# EAGLE design schematic (EAGLE 9.6.1)
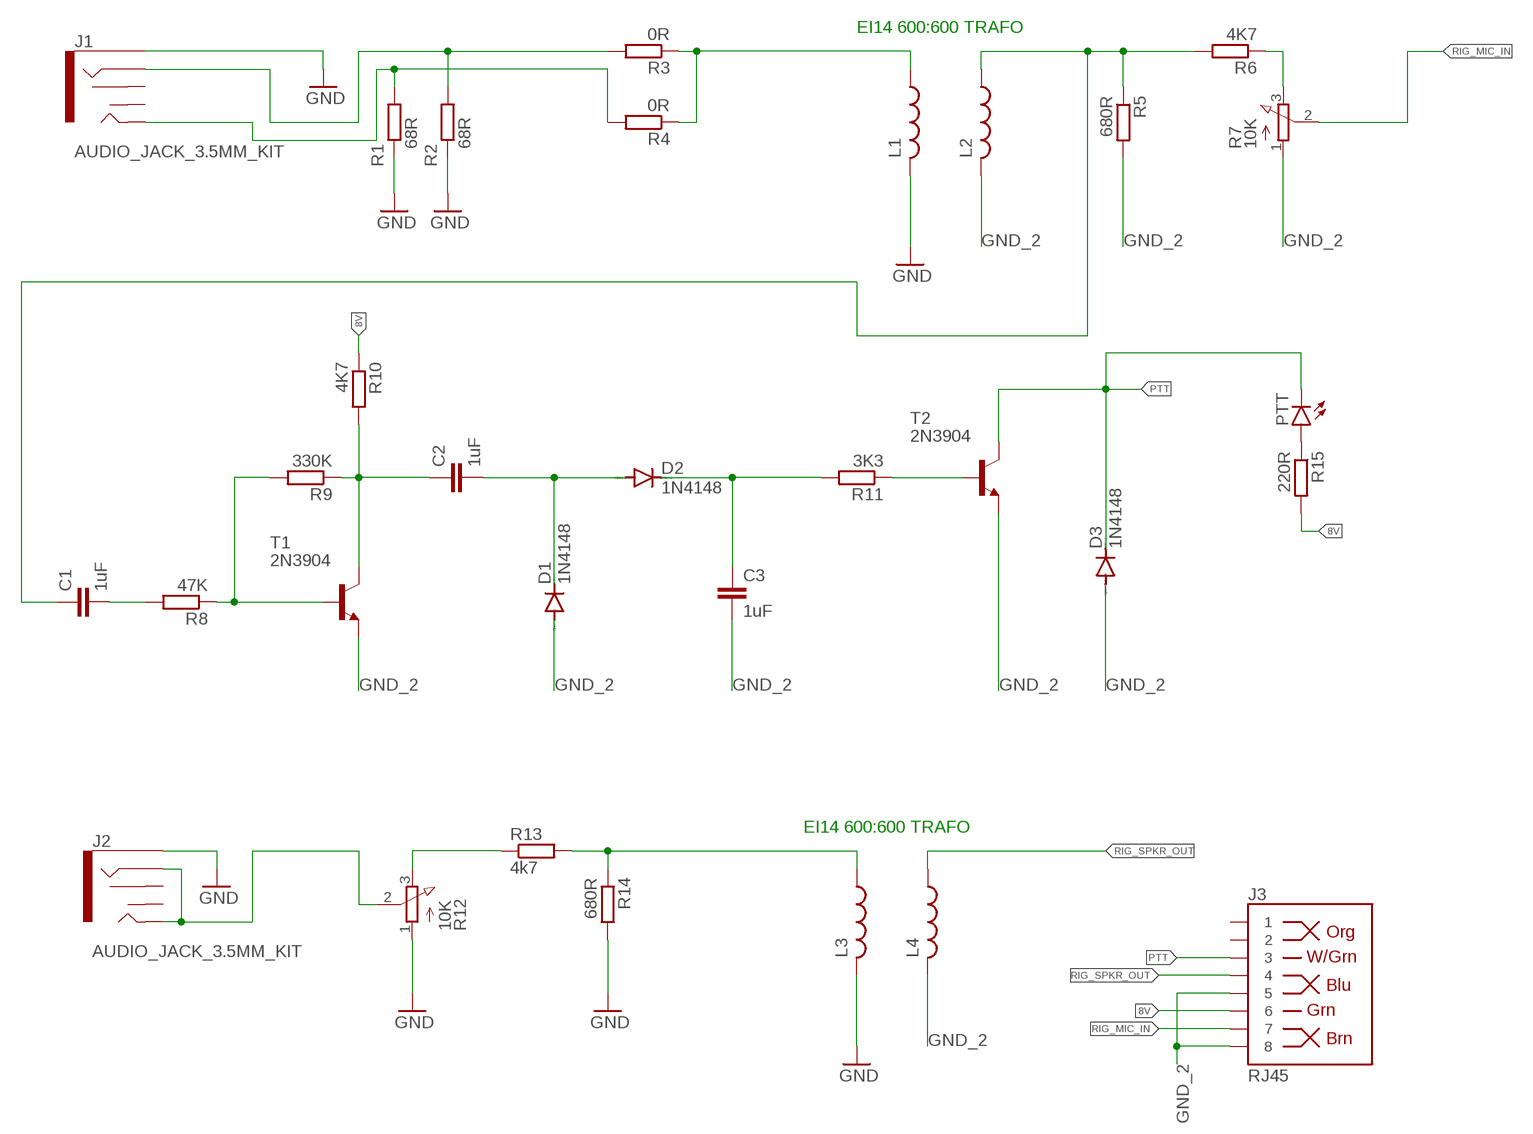
[diagram p0: schematic, sheet 1]

## Parts
C1  1uF  C-EU025-030X050  [C025-030X050]
C2  1uF  C-EU025-030X050  [C025-030X050]
C3  1uF  C-EU025-030X050  [C025-030X050]
D1  1N4148  1N4148DO35-7  [DO35-7]
D2  1N4148  1N4148DO35-7  [DO35-7]
D3  1N4148  1N4148DO35-7  [DO35-7]
J1  AUDIO_JACK_3.5MM_KIT  [AUDIO-JACK-KIT]
J2  AUDIO_JACK_3.5MM_KIT  [AUDIO-JACK-KIT]
J3  RJ45  RJ45-8  [RJ45-8]
L1  L-US0204/5  [0204/5]
L2  L-US0204/5  [0204/5]
L3  L-US0204/5  [0204/5]
L4  L-US0204/5  [0204/5]
PTT  LED5MM  [LED5MM]
R1  68R  R-EU_0207/10  [0207/10]
R2  68R  R-EU_0207/10  [0207/10]
R3  0R  R-EU_R0805  [R0805]
R4  0R  R-EU_R0805  [R0805]
R5  680R  R-EU_0207/10  [0207/10]
R6  4K7  R-EU_0207/10  [0207/10]
R7  10K  3RP/1610N  [3RP/1610N]
R8  47K  R-EU_0207/10  [0207/10]
R9  330K  R-EU_0207/10  [0207/10]
R10  4K7  R-EU_0207/10  [0207/10]
R11  3K3  R-EU_0207/10  [0207/10]
R12  10K  3RP/1610N  [3RP/1610N]
R13  4k7  R-EU_0207/10  [0207/10]
R14  680R  R-EU_0207/10  [0207/10]
R15  220R  R-EU_0207/10  [0207/10]
T1  2N3904  [TO92]
T2  2N3904  [TO92]

## Nets
8V: J3.6 R10.1 R15.2
GND: J1.SLEEVE J2.SLEEVE L1.2 L3.2 R1.1 R2.1 R12.1(A) R14.2
GND_2: C3.2 D1.A D3.A J3.5 J3.8 L2.2 L4.2 R5.2 R7.1(A) T1.3(E) T2.3(E)
N$1: J1.RING R2.2 R3.2
N$2: J1.TIP R1.2 R4.2
N$3: R12.3(E) R13.1
N$4: J2.RING J2.TIP R12.2(S)
N$5: R6.1 R7.3(E)
N$6: PTT.A R15.1
N$7: L3.1 R13.2 R14.1
N$9: C1.2 R8.2
N$10: C2.1 R9.1 R10.2 T1.1(C)
N$11: R8.1 R9.2 T1.2(B)
N$12: C2.2 D1.C D2.A
N$13: C3.1 D2.C R11.2
N$14: R11.1 T2.2(B)
N$15: C1.1 L2.1 R5.1 R6.2
N$16: L1.1 R3.1 R4.1
PTT: D3.C J3.3 PTT.K(C) T2.1(C)
RIG_MIC_IN: J3.7 R7.2(S)
RIG_SPKR_OUT: J3.4 L4.1
Unconnected: J1.RSH J1.TSH J2.RSH J2.TSH J3.1 J3.2

## Notes on the sheet
- EI14 600:600 TRAFO
- EI14 600:600 TRAFO

## Library data of the parts
C1-C3 = rcl:C-EU: CAPACITOR, European symbol; SPICEPREFIX: C
D1-D3 = diode:1N4148: DIODE high speed (Philips)
J1 J2 = SparkFun-Connectors:AUDIO_JACK_3.5MM: Audio Jack 3.5mm variants of PTH and SMT stereo audio jack with bypass switches. SparkFun Products: SparkFun SparkPunk Sound Kit <[https://www.sparkfun.com/products/11177]> - PTH MP3 Trigger <https://www.sparkfun.com/products/13720> -3.5mm SMD SparkFun PicoBoard <https://www.sparkfun.com/products/11888>- 2.5mm SMD; PROD_ID: CONN-08774; SF_ID: PRT-08032
J3 = SparkFun-Connectors:RJ45-8: RJ45 Jack - 8 pin Simple RJ45, 8-pin connection. Commonly used for Cat5, Cat5e, and Cat6 Ethernet cables. Here is the connector we sell at SparkFun: RJ45 8-Pin Connector <https://www.sparkfun.com/products/643> (PRT-00643) Datasheet <https://cdn.sparkfun.com/datasheets/Prototyping/04908.pdf> It is used on this SparkFun product: SparkFun RJ45 Breakout <https://www.sparkfun.com/products/716> (BOB-00716) Note, you may also be interested in the "MAGJACK" version of this. It is basically a RJ45 connector, but also has some status LEDs built into the connector housing. You can check that out in this library at the device named "MAGJACK.dev" and see these products online: RJ45 Ethernet MagJack-Compatible <https://www.sparkfun.com/products/8534> (PRT-08534) SparkFun RJ45 MagJack Breakout <https://www.sparkfun.com/products/13021> (BOB-13021); PROD_ID: CONN-08506; SF_ID: PRT-00643
L1-L4 = rcl:L-US: INDUCTOR, American symbol; SPICEPREFIX: L
PTT = led:LED: LED OSRAM: - CHIPLED LG R971, LG N971, LY N971, LG Q971, LY Q971, LO R971, LY R971 LH N974, LH R974 LS Q976, LO Q976, LY Q976 LO Q996 - Hyper CHIPLED LW Q18S LB Q993, LB Q99A, LB R99A - SideLED LS A670, LO A670, LY A670, LG A670, LP A670 LB A673, LV A673, LT A673, LW A673 LH A674 LY A675 LS A676, LA A676, LO A676, LY A676, LW A676 LS A679, LY A679, LG A679 - Hyper Micro SIDELED® LS Y876, LA Y876, LO Y876, LY Y876 LT Y87S - SmartLED LW L88C, LW L88S LB L89C, LB L89S, LG L890 LS L89K, LO L89K, LY L89K LS L896, LA L896, LO L896, LY L896 - TOPLED LS T670, LO T670, LY T670, LG T670, LP T670 LSG T670, LSP T670, LSY T670, LOP T670, LYG T670 LG T671, LOG T671, LSG T671 LB T673, LV T673, LT T673, LW T673 LH T674 LS T676, LA T676, LO T676, LY T676, LB T676, LH T676, LSB T676, LW T676 LB T67C, LV T67C, LT T67C, LS T67K, LO T67K, LY T67K, LW E67C LS E67B, LA E67B, LO E67B, LY E67B, LB E67C, LV E67C, LT E67C LW T67C LS T679, LY T679, LG T679 LS T770, LO T770, LY T770, LG T770, LP T770 LB T773, LV T773, LT T773, LW T773 LH T774 LS E675, LA E675, LY E675, LS T675 LS T776, LA T776, LO T776, LY T776, LB T776 LHGB T686 LT T68C, LB T68C - Hyper Mini TOPLED® LB M676 - Mini TOPLED Santana® LG M470 LS M47K, LO M47K, LY M47K Source: http://www.osram.convergy.de LUXEON: - LUMILED® LXK2-PW12-R00, LXK2-PW12-S00, LXK2-PW14-U00, LXK2-PW14-V00 LXK2-PM12-R00, LXK2-PM12-S00, LXK2-PM14-U00 LXK2-PE12-Q00, LXK2-PE12-R00, LXK2-PE12-S00, LXK2-PE14-T00, LXK2-PE14-U00 LXK2-PB12-K00, LXK2-PB12-L00, LXK2-PB12-M00, LXK2-PB14-N00, LXK2-PB14-P00, LXK2-PB14-Q00 LXK2-PR12-L00, LXK2-PR12-M00, LXK2-PR14-Q00, LXK2-PR14-R00 LXK2-PD12-Q00, LXK2-PD12-R00, LXK2-PD12-S00 LXK2-PH12-R00, LXK2-PH12-S00 LXK2-PL12-P00, LXK2-PL12-Q00, LXK2-PL12-R00 Source: www.luxeon.com KINGBRIGHT: KA-3528ASYC Source: www.kingbright.com
R1-R6 R8-R11 R13-R15 = rcl:R-EU_: RESISTOR, European symbol; SPICEPREFIX: R
R7 R12 = pot:3RP/1610N: 16mm Potentiometer one level Source: http://www.alphapotentiometers.net/html/16mm_pot_2.html
T1 T2 = transistor:2N3904: NPN TRANSISTOR

## Board
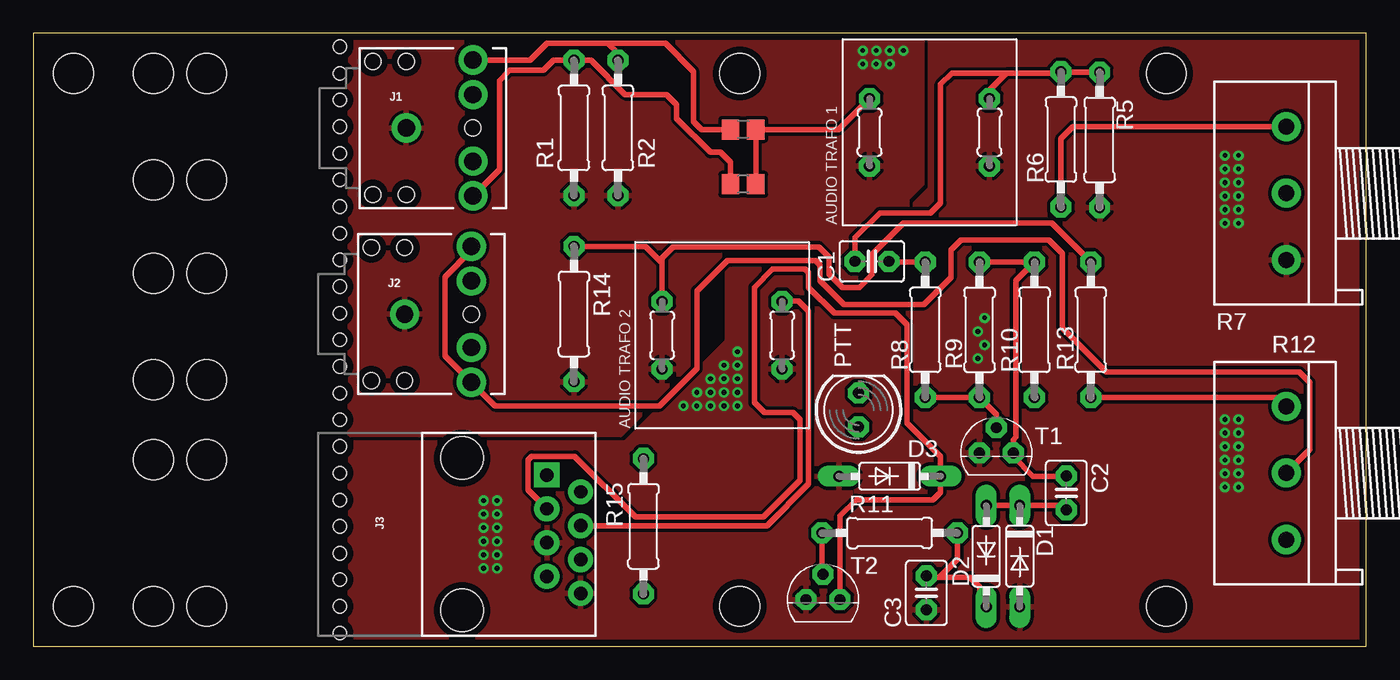
[diagram p1: board, top side]
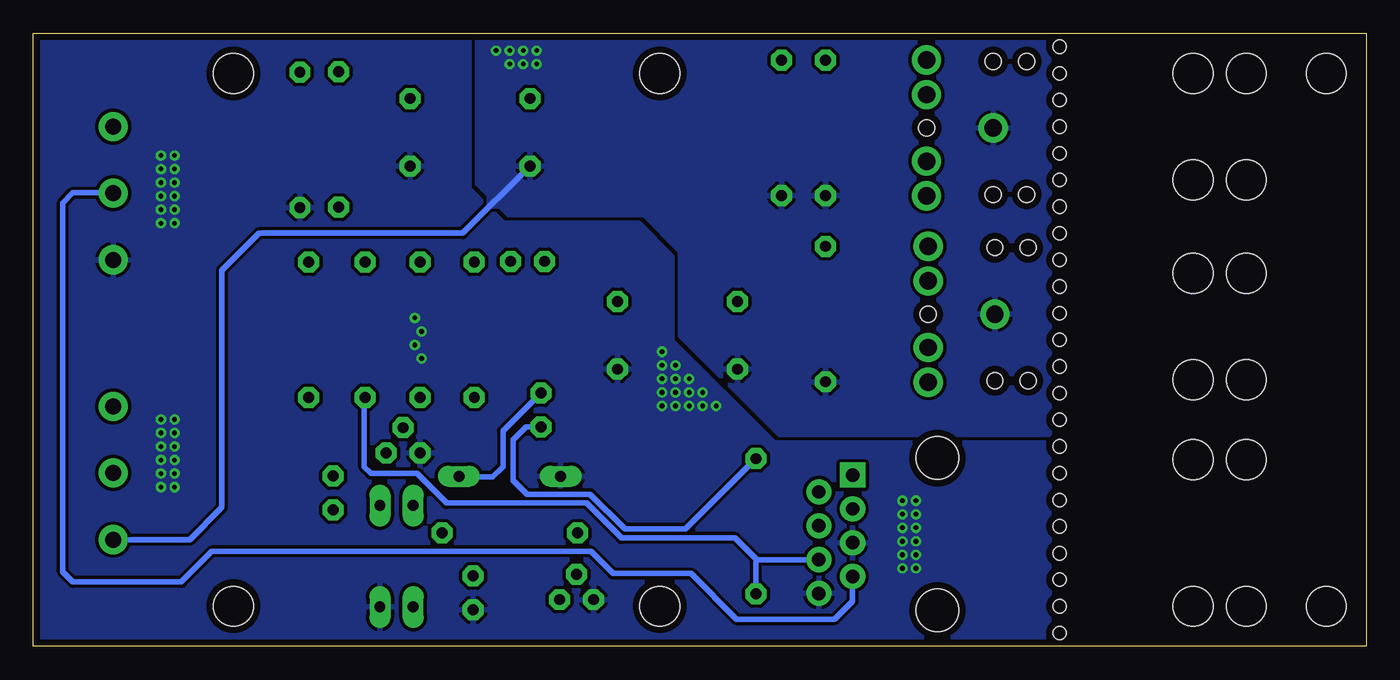
[diagram p2: board, bottom side, seen from below]

Size 100 x 46 mm. Coordinates in mm from the lower left corner, seen from the top.
Outline: 0,0 100,0 100,46 0,46 0,0
Copper layers (1*16): Top 0.035mm / dielectric 1.5mm / Bottom 0.035mm
Design rules "default *": minimum track width 6mil, minimum drill 0.35mm, track to track 10mil, track to pad 10mil, pad to pad 10mil, via to via 10mil, smd to smd 10mil, copper to edge 20mil, drill to drill 6mil, minimum pad ring 15mil, minimum via ring 8mil, stop-mask expansion 4mil, vias tented up to drill 30mil, thermal gap 10mil
Holes 3 mm at 53,43 53,3 85,43 85,3 3,43 3,3 9,43 13,43 9,35 13,35 9,28 13,28 9,20 13,20 9,14 13,14 9,3 13,3
Holes 1 mm at 23,13 23,9 23,1 23,3 23,5 23,10.97 23,6.97 23,15 23,17 23,19 23,21 23,23 23,25 23,27 23,29 23,31 23,33 23,35 23,37 23,39 23,41 23,43 23,45

### Footprints (pad centres in the part's own frame; a part is rotated, then mirrored left to right if it is on the bottom)
C025-030X050 = drill 0.813 octagon: 1 -1.27,0; 2 1.27,0
DO35-7 = drill 0.813 long: A 3.81,0; C -3.81,0
AUDIO-JACK-KIT = drill 1.3 pad 2.184: RING 5,5.1; RSH 5,2.5; SLEEVE 0,0; TIP 5,-5.1; TSH 5,-2.5 | hole 1.2: 0,5; -2.5,5; -2.5,-5; 0,-5; 5,0
RJ45-8 = drill 1 pad 1.88 square: 1 -4.445,6.35 | drill 1 pad 1.88: 2 -3.175,8.89; 3 -1.905,6.35; 4 -0.635,8.89; 5 0.635,6.35; 6 1.905,8.89; 7 3.175,6.35; 8 4.445,8.89 | hole 3.2: -5.715,0; 5.715,0
0204/5 = drill 0.813 octagon: 1 -2.54,0; 2 2.54,0
LED5MM = drill 0.813 octagon: A -1.27,0; K 1.27,0
0207/10 = drill 0.813 octagon: 1 -5.08,0; 2 5.08,0
R0805 = smd 1.3 x 1.5: 1 -0.95,0; 2 0.95,0
3RP/1610N = drill 1.2 pad 2.184: 1 -5,0; 2 0,0; 3 5,0
TO92 = drill 0.813 octagon: 1 1.27,0; 2 0,1.905; 3 -1.27,0

### Placement (x,y rotation side)
C1  62.91,28.88 0 top
C2  77.5,11.5 270 top
C3  67,4 270 top
D1  74,6.75 270 top
D2  71.5,6.75 90 top
D3  64.25,12.75 180 top
J1  27.98,38.9 0 top
J2  27.86,24.91 0 top
J3  32.18,8.4 270 top
L1  62.74,38.57 270 top
L2  71.74,38.57 270 top
L3  47.18,23.33 270 top
L4  56.18,23.33 270 top
PTT  61.91,17.73 90 top
R1  40.56,38.9 90 top
R2  43.86,38.9 90 top
R3  53.26,38.78 180 top
R4  53.26,34.68 180 top
R5  80,38 270 top
R6  77.1,38.03 90 top
R7  94,34 90 top
R8  66.92,23.75 90 top
R9  70.99,23.75 270 top
R10  75.11,23.75 90 top
R11  64.25,8.5 0 top
R12  94,13 90 top
R13  79.34,23.75 90 top
R14  40.56,24.93 270 top
R15  45.78,9 270 top
T1  72.25,14.5 0 top
T2  59.25,3.5 0 top

### Tracks (layer width: path | path; a pad name or v marks a point on that pad's centre or on a via)
8V
  Bottom 0.406: R10.1 75.17,18.61 75.17,13.46 74.66,12.95 71.2,12.95 69,10.75 58.5,10.75 55.88,8.13 47.35,8.13 45.72,6.5 | J3.6 44,6.5 45.72,6.5 | 45.72,6.5 45.78,6.5 R15.2
GND  (via drill 0.35)
  Bottom 0.406: L1.2 67.78,30.99 83.06,30.99 85.85,28.19 85.85,10.41 88.27,8 R12.1
  other vias: 62.23,44.7 63.25,44.7 64.26,44.7 65.28,44.7 64.26,43.69 63.25,43.69 62.23,43.69
  pour Top (isolate 0.051, rank 2): 21.59,47.78 21.59,-5.08 106.68,-5.08 106.68,47.78
  pour Bottom (isolate 0.051, rank 2): 17.82,46.78 17.82,-5.08 105.41,-5.08 105.41,46.78
GND_2  (via drill 0.35)
  other vias: 89.41,36.83 90.42,36.83 89.41,35.81 90.42,35.81 89.41,34.8 90.42,34.8 89.41,33.78 90.42,33.78 89.41,32.77 90.42,32.77 89.41,31.75 90.42,31.75 89.41,17.02 90.42,17.02 89.41,16 90.42,16 89.41,14.99 90.42,14.99 89.41,13.97 90.42,13.97 89.41,12.95 90.42,12.95 89.41,11.94 90.42,11.94 33.78,10.92 34.8,10.92 33.78,9.91 34.8,9.91 33.78,8.89 34.8,8.89 33.78,7.87 34.8,7.87 33.78,6.86 34.8,6.86 33.78,5.84 34.8,5.84 52.83,22.1 51.82,21.08 52.83,21.08 50.8,20.07 51.82,20.07 52.83,20.07 52.83,19.05 51.82,19.05 50.8,19.05 49.78,19.05 48.77,18.03 49.78,18.03 50.8,18.03 51.82,18.03 52.83,18.03 71.37,24.64 70.87,23.62 71.37,22.61 70.87,21.59
  pour Top (isolate 0.051): 21.59,-1.27 101.6,-1.27 101.6,46.99 67.31,46.99 67.31,34.29 64.77,31.75 62.23,31.75 54.61,31.75 52.07,29.21 52.07,22.86 48.26,19.05 46.99,17.78 44.45,15.24 21.59,15.24
  pour Bottom (isolate 0.051): 21.59,-1.27 100.33,-1.27 100.33,46.99 67.31,46.99 67.31,34.29 64.77,31.75 54.61,31.75 52.07,29.21 52.07,22.86 44.45,15.24 21.59,15.24
N$1
  Top 0.406: J1.RING 37.28,44 38.53,45.25 43.1,45.25 | 43.1,45.25 43.86,44.49 R2.2 | 43.1,45.25 47.42,45.25 49.53,43.14 49.53,39.37 50.12,38.78 R3.2
N$2
  Top 0.406: J1.TIP 34.97,35.78 34.97,42.46 35.73,43.22 38.27,43.22 39.03,43.98 R1.2 41.83,43.98 44.41,41.4 47.5,41.4 48.26,40.64 48.26,39.61 50.79,37.08 51.57,37.08 52.32,36.32 52.31,36.31 R4.2
N$3
  Top 0.406: R13.1 93.33,18.67 R12.3
N$4
  Top 0.406: J2.RING 32.86,29.68 30.91,27.72 30.91,21.77 J2.TIP 34.64,18.03 46.99,18.03 49.78,20.83 49.78,26.67 52.07,28.96 58.67,28.96 59.03,28.6 59.03,27.43 60.81,25.65 66.8,25.65 68.83,27.69 68.83,29.72 69.6,30.48 76.2,30.48 77.22,29.46 77.22,23.88 80.52,20.57 95,20.57 95.76,19.81 95.76,14.76 R12.2
N$5
  Top 0.406: R6.1 77.1,38.1 78,39 R7.3
N$6
  Bottom 0.406: PTT.A 63.05,16.46 64.01,15.49 64.01,12.45 62.97,11.41 58.23,11.41 55.6,8.79 51.07,8.79 R15.1
N$7
  Top 0.406: R14.1 45.94,30.01 47.18,28.77 | 47.18,28.77 L3.1 | R13.2 76.41,31.75 65.28,31.75 65.28,31.74 62.94,29.4 62.94,27.89 61.98,26.92 60.71,26.92 59.69,27.94 59.69,29.21 58.93,29.97 48.01,29.97 47.18,29.14 47.18,28.77
N$9
  Top 0.406: C1.2 64.24,28.83 R8.2
N$10
  Top 0.406: C2.1 77.48,12.75 75,12.75 73.52,14.23 T1.1 73.52,15.5 73.71,15.69 73.71,27.44 R10.2 R9.1
N$11
  Top 0.406: R8.1 R9.2 72.25,17.41 T1.2
N$12
  Top 0.406: C2.2 77.17,10.56 D1.C D2.A
N$13
  Top 0.406: R11.2 69.33,6.52 67.99,5.18 | 67.99,5.18 67.09,5.18 C3.1 | D2.C 71.04,3.41 71.04,4.42 70.28,5.18 67.99,5.18
N$14
  Top 0.406: T2.2 59.17,5.49 R11.1
N$15
  Top 0.406: C1.1 61.64,30.65 63.5,32.51 67.31,32.51 68.07,33.27 68.07,42.16 68.91,43 73,43 | R6.2 77.07,43.08 | 73,43 76.99,43 77.07,43.08 | 73,43 71.74,41.74 L2.1 | R5.1 77.07,43.08
N$16
  Top 0.406: L1.1 60.4,38.78 R3.1 R4.1
PTT
  Top 0.406: T2.1 60.52,9.77 61.75,11 67.5,11 68.06,11.56 D3.C 68.06,14.24 65.53,16.76 65.53,24.13 64.67,24.99 60.1,24.99 58.17,26.92 58.17,28.04 57.91,28.3 55.47,28.3 54.1,26.92 54.1,18.29 54.86,17.53 57,17.53 57.51,17.02 57.51,12.44 54.77,9.7 45.16,9.7 40.62,14.25 37.4,14.25 37.13,13.98 37.13,11.72 38.53,10.32 J3.3
  Bottom 0.406: PTT.K 64.77,16.14 64.77,13.46 65.53,12.7 68.01,12.7 D3.C
RIG_MIC_IN
  Bottom 0.406: J3.7 38.53,3.38 39.88,2.03 47.24,2.03 50.67,5.46 56.52,5.46 58.17,7.11 86.61,7.11 88.9,4.83 97.03,4.83 97.79,5.59 97.79,33.27 97.03,34.04 94.04,34.04 R7.2
RIG_SPKR_OUT
  Top 0.406: J3.4 55.04,9.04 58.17,12.17 58.17,25.15 57.4,25.91 56.21,25.91 L4.1

### Text on the board
tPlace: AUDIO TRAFO 1 | AUDIO TRAFO 2
tValues: AUDIO IN RING | AUDIO IN TIP
bValues: https://github.com/ivica3730k/AFSK-Ham-Radio-Interface | https://ivica-matic.com
Document: PC SPKR OUT | RIG INPUT LEVEL | PC MIC INPUT | RIG IO | 3 -> PTT / 4 -> AF / 5 -> GND / 6 -> VCC / 7 -> MOD IN / 8 -> GND | RIG OUTPUT LEVEL | AFSK Modes Interface / 11/2020 - 9A3ICE
_tNames: J1 | R5 | R1 | R2 | R6 | R14 | J2 | C1 | R7 | R12 | PTT | R8 | R9 | R10 | R13 | D3 | T1 | C2 | R15 | J3 | R11 | D1 | T2 | C3 | D2